# EAGLE design ping_breakout (EAGLE 5.11)
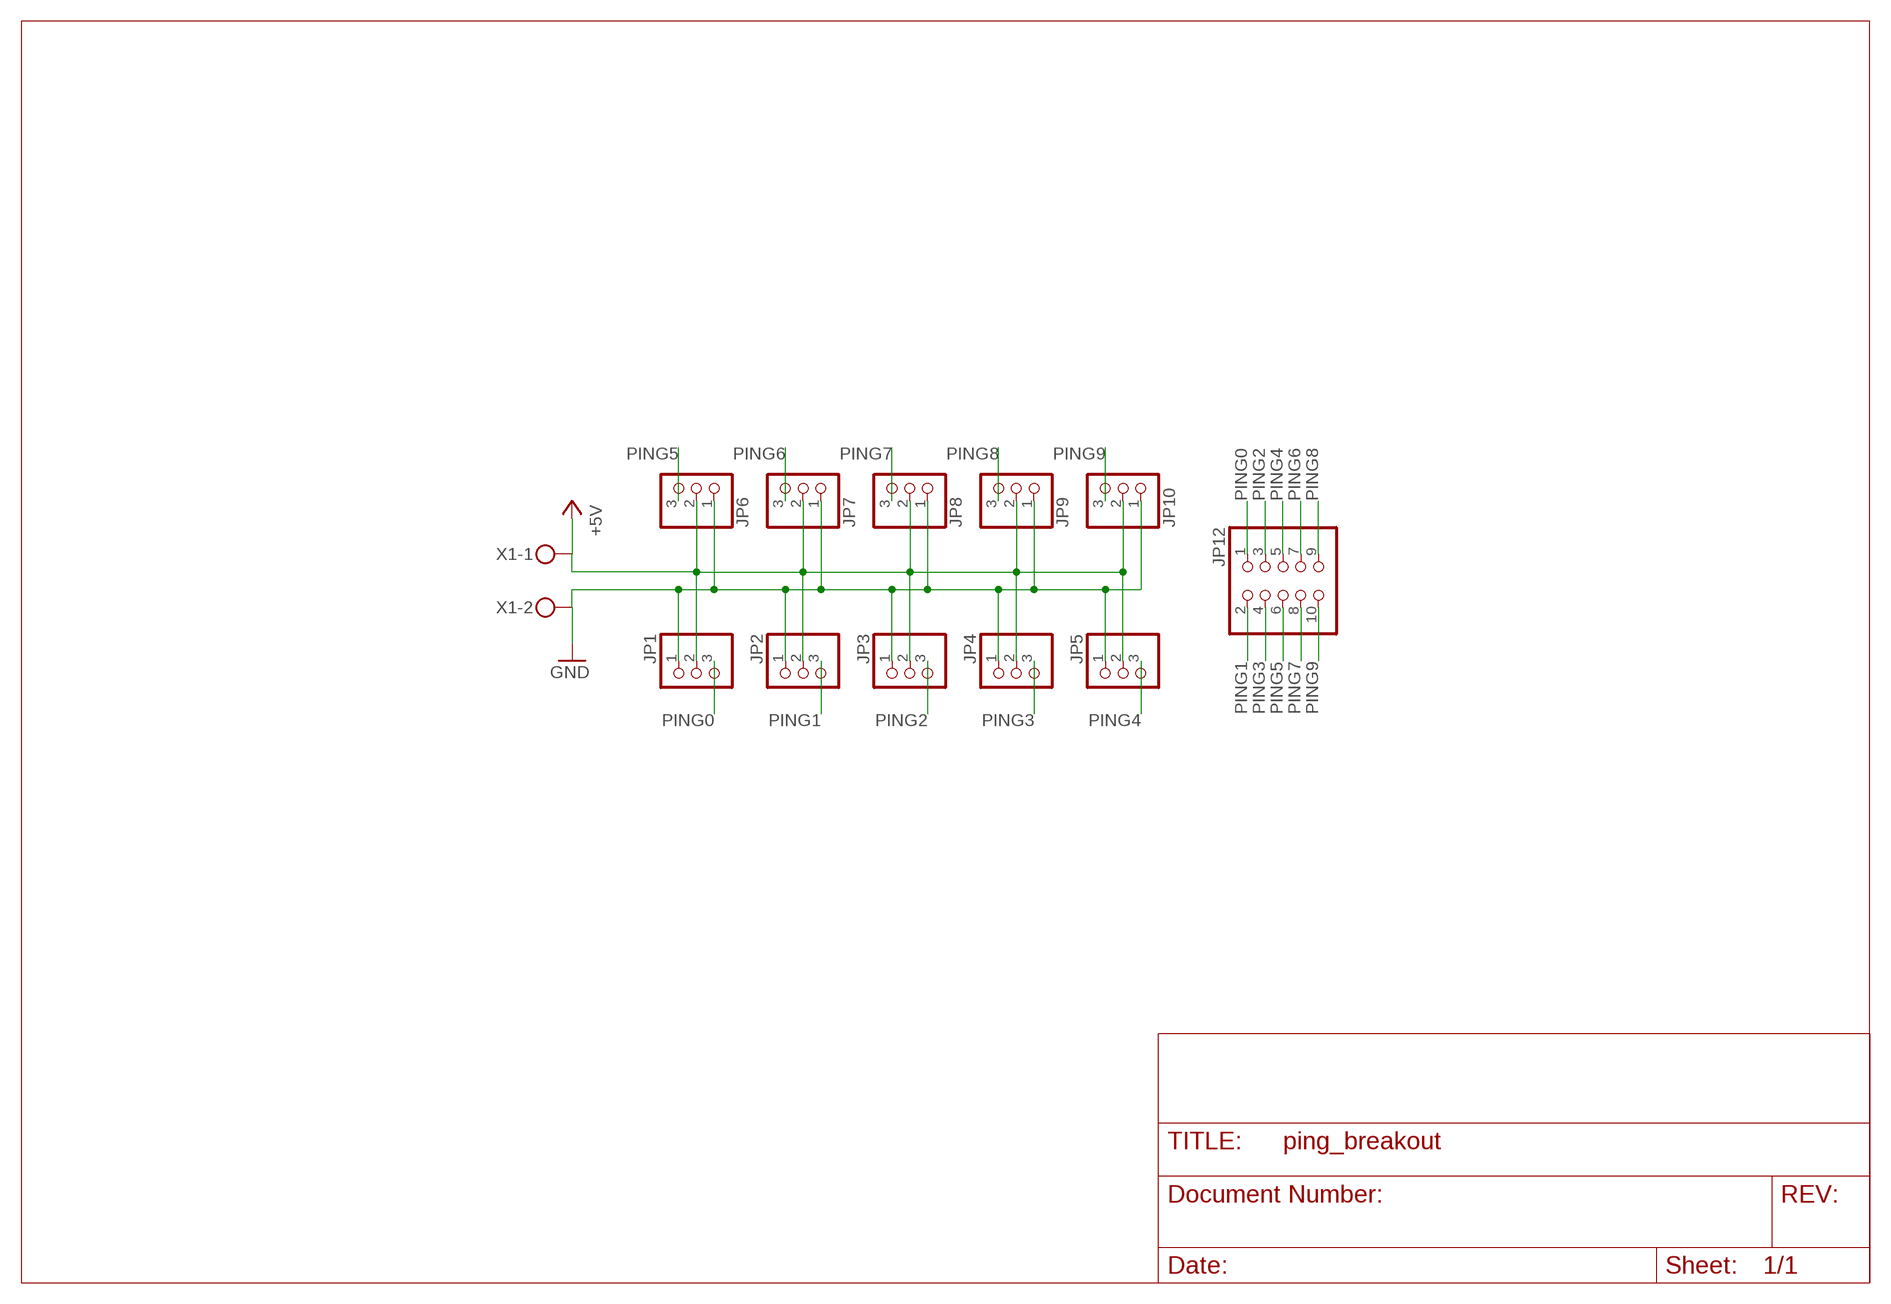
[diagram p0: schematic, sheet 1]

## Parts
JP1  PINHD-1X3  [1X03]
JP2  PINHD-1X3  [1X03]
JP3  PINHD-1X3  [1X03]
JP4  PINHD-1X3  [1X03]
JP5  PINHD-1X3  [1X03]
JP6  PINHD-1X3  [1X03]
JP7  PINHD-1X3  [1X03]
JP8  PINHD-1X3  [1X03]
JP9  PINHD-1X3  [1X03]
JP10  PINHD-1X3  [1X03]
JP12  PINHD-2X5  [2X05]
X1  MKDSN1,5/2-5,08  [MKDSN1,5/2-5,08]

## Nets
+5V: JP1.2 JP2.2 JP3.2 JP4.2 JP5.2 JP6.2 JP7.2 JP8.2 JP9.2 JP10.2 X1.1
GND: JP1.1 JP2.1 JP3.1 JP4.1 JP5.1 JP6.1 JP7.1 JP8.1 JP9.1 JP10.1 X1.2
PING0: JP1.3 JP12.1
PING1: JP2.3 JP12.2
PING2: JP3.3 JP12.3
PING3: JP4.3 JP12.4
PING4: JP5.3 JP12.5
PING5: JP6.3 JP12.6
PING6: JP7.3 JP12.7
PING7: JP8.3 JP12.8
PING8: JP9.3 JP12.9
PING9: JP10.3 JP12.10

## Library data of the parts
JP1-JP10 = pinhead:PINHD-1X3: PIN HEADER
JP12 = pinhead:PINHD-2X5: PIN HEADER
X1 = con-phoenix-508:MKDSN1,5/2-5,08: MKDSN 1,5/ 2-5,08 Printklemme Nennstrom: 13,5 A Nennspannung: 250 V Rastermaß: 5,08 mm Polzahl: 2 Anschlussart: Schraubanschluss Montage: Löten Anschlussrichtung Leiter/Platine: 0 ° Artikelnummer: 1729128 Source: http://eshop.phoenixcontact.com .. 1729128.pdf; MPN: MKDSN 1,5/2-5.08; OC_FARNELL: 1792903; OC_NEWARK: 30M2397

## Board
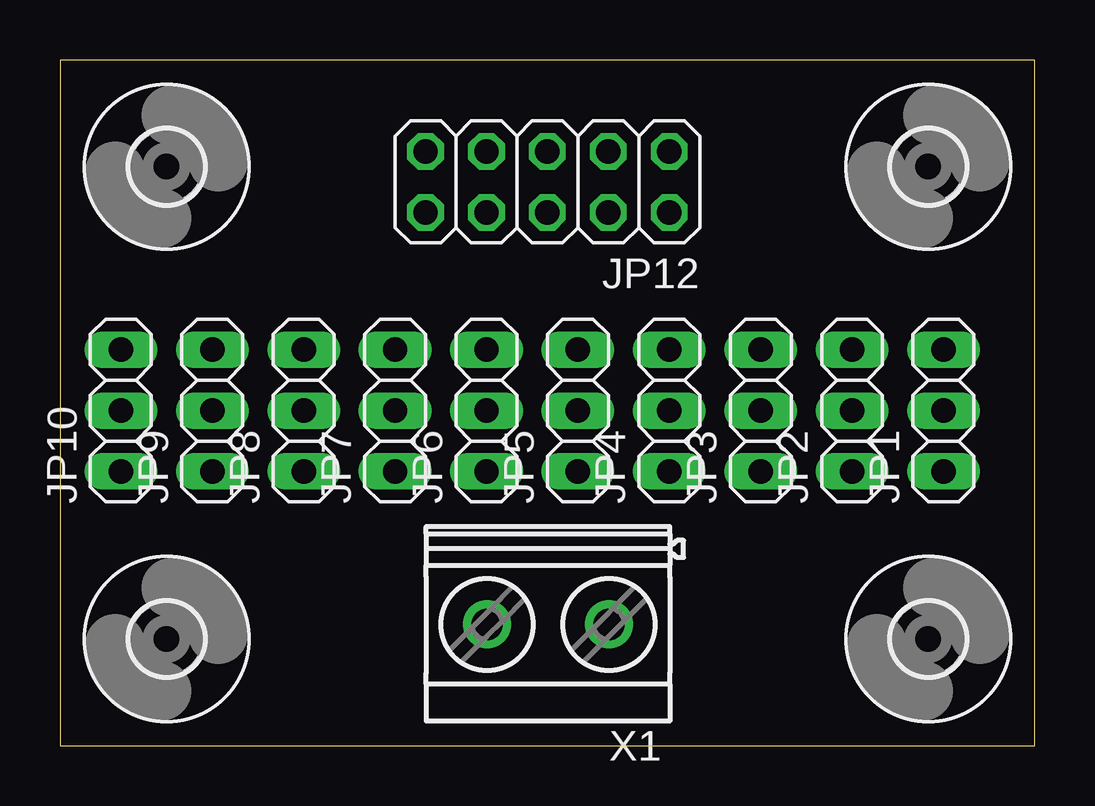
[diagram p1: board, top side]
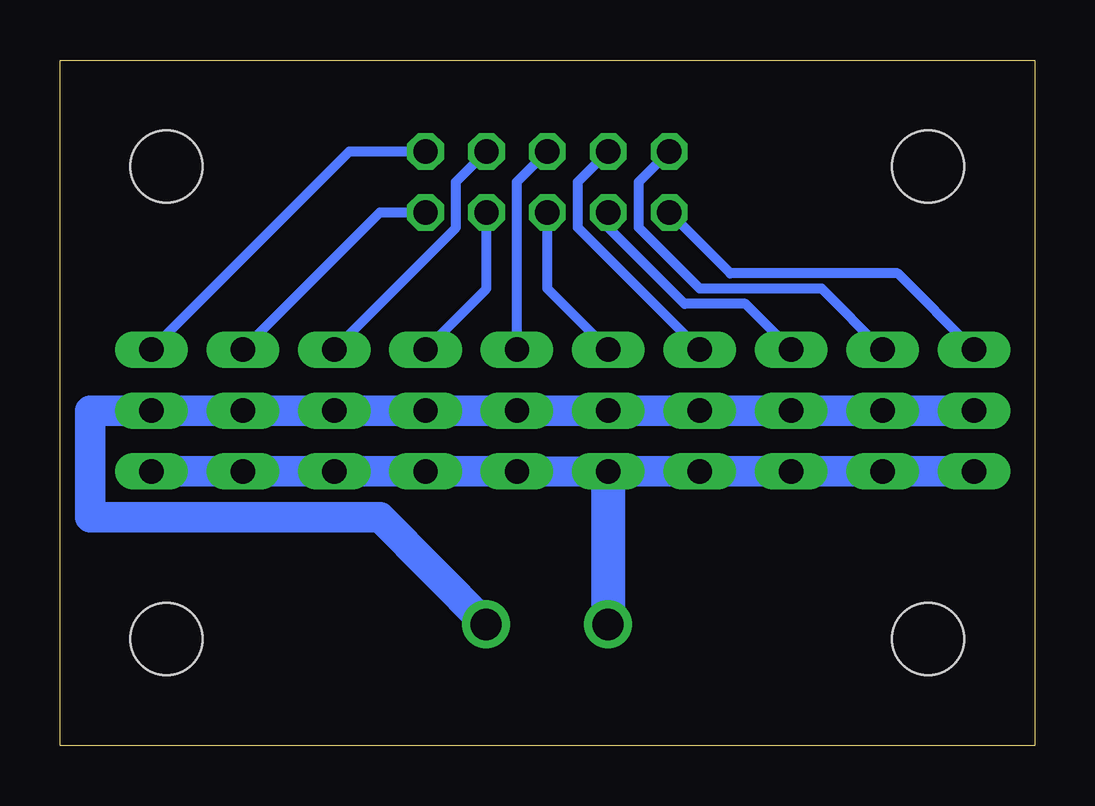
[diagram p2: board, bottom side, seen from below]

Size 40.64 x 28.57 mm. Coordinates in mm from the lower left corner, seen from the top.
Outline: 0,0 40.64,0 40.64,28.57 0,28.57 0,0
Copper layers (1*16): Top 0.035mm / dielectric 1.5mm / Bottom 0.035mm
Design rules "default": minimum track width 10mil, minimum drill 24mil, track to track 8mil, track to pad 8mil, pad to pad 8mil, via to via 8mil, smd to smd 8mil, copper to edge 40mil, drill to drill 8mil, minimum pad ring 10mil, minimum via ring 8mil, stop-mask expansion 4mil, vias tented up to drill 0mil, thermal gap 10mil

### Footprints (pad centres in the part's own frame; a part is rotated, then mirrored left to right if it is on the bottom)
1X03 = drill 1.016 long: 1 -2.54,0; 2 0,0; 3 2.54,0
2X05 = drill 1.016 octagon: 1 -5.08,-1.27; 2 -5.08,1.27; 3 -2.54,-1.27; 4 -2.54,1.27; 5 0,-1.27; 6 0,1.27; 7 2.54,-1.27; 8 2.54,1.27; 9 5.08,-1.27; 10 5.08,1.27
3,0 = hole 3: 0,0
MKDSN1,5/2-5,08 = drill 1.3 pad 2 round: 1 -2.561,0.025; 2 2.519,0.025

### Placement (x,y rotation side)
JP1  36.83,13.97 90 top
JP2  33.02,13.97 90 top
JP3  29.21,13.97 90 top
JP4  25.4,13.97 90 top
JP5  21.59,13.97 90 top
JP6  17.78,13.97 90 top
JP7  13.97,13.97 90 top
JP8  10.16,13.97 90 top
JP9  6.35,13.97 90 top
JP10  2.54,13.97 90 top
JP12  20.32,23.5 180 top
U$1  [3,0]  4.45,4.45 0 top
U$2  [3,0]  4.45,24.13 0 top
U$3  [3,0]  36.2,4.45 0 top
U$4  [3,0]  36.2,24.13 0 top
X1  20.32,5.08 180 top

### Tracks (layer width: path | path; a pad name or v marks a point on that pad's centre or on a via)
+5V
  Bottom 1.27: JP10.2 JP9.2 JP8.2 JP7.2 JP6.2 JP5.2 JP4.2 JP3.2 JP2.2 JP1.2 39.37,13.97 39.37,9.53 27.3,9.53 X1.1
GND
  Bottom 0.55: JP6.1 17.8,11.41
  Bottom 1.27: JP10.1 JP9.1 JP8.1 JP7.1 JP6.1 | 17.8,11.41 JP5.1 JP4.1 JP3.1 JP2.1 JP1.1
  Bottom 1.422: 17.8,11.41 X1.2
PING0
  Bottom 0.406: JP1.3 28.57,24.77 JP12.1
PING1
  Bottom 0.406: JP2.3 27.3,22.23 JP12.2
PING2
  Bottom 0.406: JP3.3 24.13,21.59 24.13,23.5 JP12.3
PING3
  Bottom 0.406: JP4.3 22.86,19.05 JP12.4
PING4
  Bottom 0.406: JP5.3 21.59,23.5 JP12.5
PING5
  Bottom 0.406: JP6.3 20.32,19.05 JP12.6
PING6
  Bottom 0.406: JP12.7 19.05,23.5 19.05,21.59 JP7.3
PING7
  Bottom 0.406: JP8.3 12.06,18.41 14.61,18.41 17.78,21.59 JP12.8
PING8
  Bottom 0.406: JP9.3 8.89,19.05 13.97,19.05 16.51,21.59 16.51,23.5 JP12.9
PING9
  Bottom 0.406: JP10.3 5.71,19.68 12.7,19.68 JP12.10